# Altium schematic sheet Motor_2.SchDoc
size A4
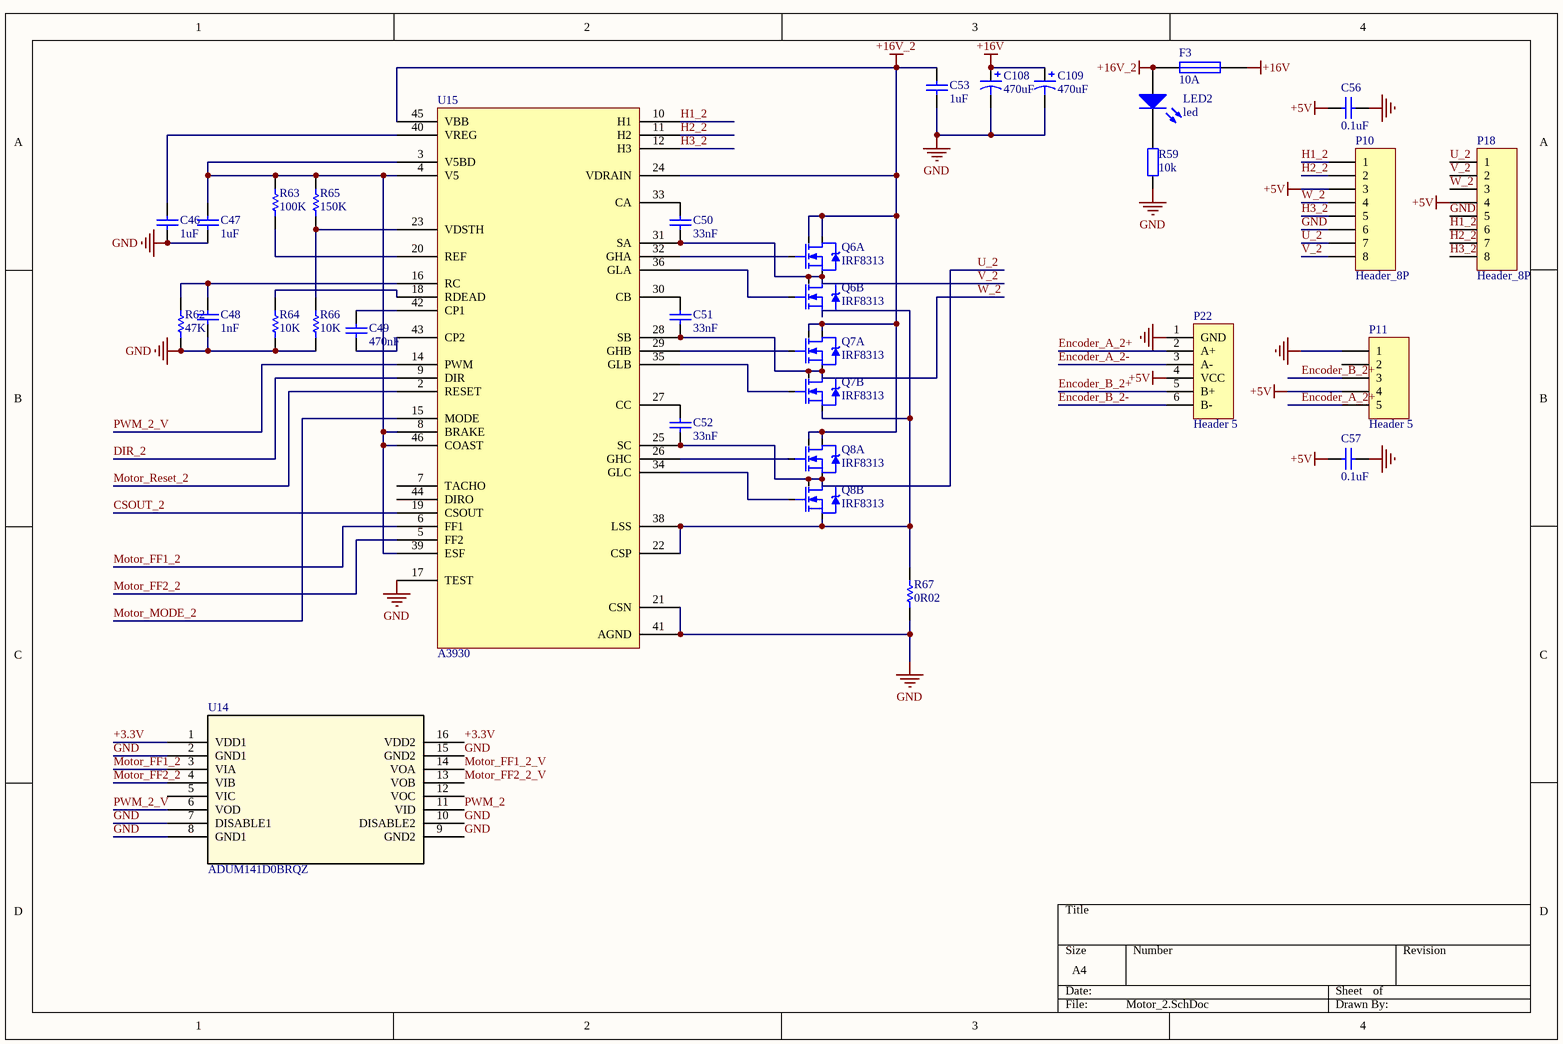
[diagram p0: Motor_2.SchDoc]

## Parts
C46  1uf  [0603C]
C47  1uf  [0603C]
C48  1nf  [0603C]
C49  470nf  [0603C]
C50  33nf  [0603C]
C51  33nf  [0603C]
C52  33nf  [0603C]
C53  1uf  [0603C]
C56  0.1uf  [0603C]
C57  0.1uf  [0603C]
C108  470uF  [470uF]
C109  470uF  [470uF]
F3  10A  [FUSE_HEADER]
LED2  led  [0603_diode]
P10  Header_8P  [8P - WF25122]
P11  Header 5  [SHDR5]
P18  Header_8P  [SHDR8]
P22  Header 5  [SHDR6]
Q6  IRF8313  [so-8 bg]  (parts A,B of 2)
Q7  IRF8313  [so-8 bg]  (parts A,B of 2)
Q8  IRF8313  [so-8 bg]  (parts A,B of 2)
R59  10k  [0603]
R62  47k  [0603R]
R63  100k  [0603R]
R64  10k  [0603R]
R65  value 150K  [0603R]  (hidden comment: 100k)
R66  10k  [0603R]
R67  value 0R02  [1206 10A]  (hidden comment: 0.02)
U14  ADUM141D0BRQZ  [RQ_16]
U15  A3930  [LQFP-48]

## Nets
+5V: C56.2 C57.2 P10.3 P11.4 P18.4 P22.4(VCC)
+16V: C108.1 C109.1 F3.1
+16V_2: C53.2 F3.2 LED2.1(A) Q6.7(D2) Q6.8(D2) Q7.7(D2) Q7.8(D2) Q8.7(D2) Q8.8(D2) U15.24(VDRAIN) U15.45(VBB)
GND: C46.1 C47.1 C48.1 C53.1 C56.1 C57.1 C108.2 C109.2 P10.6 P11.1 P18.5 P22.1(GND) R59.1 R62.1 R64.1 R66.1 R67.1 U14.2(GND1) U14.7(DISABLE1) U14.8(GND1) U14.9(GND2) U14.10(DISABLE2) U14.15(GND2) U15.17(TEST) U15.21(CSN) U15.41(AGND)
+3.3V: U14.1(VDD1) U14.16(VDD2)
CSOUT_2: U15.19(CSOUT)
DIR_2: U15.9(DIR)
Encoder_A_2+: P11.5 P22.2(A+)
Encoder_A_2-: P22.3(A-)
Encoder_B_2+: P11.3 P22.5(B+)
Encoder_B_2-: P22.6(B-)
H1_2: P10.1 P18.6 U15.10(H1)
H2_2: P10.2 P18.7 U15.11(H2)
H3_2: P10.5 P18.8 U15.12(H3)
Motor_FF1_2: U14.3(VIA) U15.6(FF1)
Motor_FF1_2_V: U14.14(VOA)
Motor_FF2_2: U14.4(VIB) U15.5(FF2)
Motor_FF2_2_V: U14.13(VOB)
Motor_MODE_2: U15.15(MODE)
Motor_Reset_2: U15.2(RESET)
PWM_2: U14.11(VID)
PWM_2_V: U14.6(VOD) U15.14(PWM)
U_2: C52.1 P10.7 P18.1 Q8.1(S2) Q8.5(D1) Q8.6(D1) U15.25(SC)
V_2: C50.1 P10.8 P18.2 Q6.1(S2) Q6.5(D1) Q6.6(D1) U15.31(SA)
W_2: C51.1 P10.4 P18.3 Q7.1(S2) Q7.5(D1) Q7.6(D1) U15.28(SB)
NetC46_2: C46.2 U15.40(VREG)
NetC47_2: C47.2 R63.2 R65.2 U15.3(V5BD) U15.4(V5) U15.8(BRAKE) U15.39(ESF) U15.46(COAST)
NetC48_2: C48.2 R62.2 U15.16(RC)
NetC49_1: C49.1 U15.43(CP2)
NetC49_2: C49.2 U15.42(CP1)
NetC50_2: C50.2 U15.33(CA)
NetC51_2: C51.2 U15.30(CB)
NetC52_2: C52.2 U15.27(CC)
NetLED2_2: LED2.2(K) R59.2
NetQ6_2: Q6.2(G2) U15.32(GHA)
NetQ6_3: Q6.3(S1) Q7.3(S1) Q8.3(S1) R67.2 U15.22(CSP) U15.38(LSS)
NetQ6_4: Q6.4(G1) U15.36(GLA)
NetQ7_2: Q7.2(G2) U15.29(GHB)
NetQ7_4: Q7.4(G1) U15.35(GLB)
NetQ8_2: Q8.2(G2) U15.26(GHC)
NetQ8_4: Q8.4(G1) U15.34(GLC)
NetR63_1: R63.1 U15.20(REF)
NetR64_2: R64.2 U15.18(RDEAD)
NetR65_1: R65.1 R66.2 U15.23(VDSTH)

Not connected (* = marked no-connect by the designer): P11 2; U14 5(VIC) 12(VOC); U15 7(TACHO) 44(DIRO)

## Library data of the parts
C46-C53 C56 C57 = Cap: Capacitor; Manufacturer: Generic Components; Class: Passive; Published: 08/06/2000; Publisher: Altium Hobart Technology Centre; SubClass: Capacitor
  C46 C47 C53: Value: 1uF
  C48: Value: 1nF
  C49: Value: 470nF
  C50-C52: Value: 33nF
  C56 C57: Value: 0.1uF
C108 C109 = Cap Pol1: Polarized Capacitor (Radial); Published: 8-Jun-2000; LatestRevisionDate: 17-Jul-2002; LatestRevisionNote: Re-released for DXP Platform.; PackageReference: RB7.6-15; Publisher: Altium Limited; PackageDescription: Polarized Capacitor (Radial); 2 Leads
F3 = FUSE
P10 P18 = Header_8P: Used for Motor connection in ZJUNlict
P11 = Header 5: Header, 5-Pin; LatestRevisionDate: 17-Jul-2002; LatestRevisionNote: Re-released for DXP Platform.; Publisher: Altium Limited
P22 = Header 6: Header, 5-Pin; LatestRevisionDate: 17-Jul-2002; LatestRevisionNote: Re-released for DXP Platform.; Publisher: Altium Limited
Q6-Q8 = SO-8 IRF8313
R59 = res
R62-R67 = Res1: Resistor; Manufacturer: Generic Components; Class: Passive; Published: 08/06/2000; Publisher: Altium Hobart Technology Centre; SubClass: Resistor
  R62: Value: 47K
  R63: Value: 100K
  R64 R66: Value: 10K
U14 = ADUM141D0BRQZ: Imported; RefDes: RefDes; Type: DEV; Value: Value
U15 = LQFP 48